# Altium project brian_project.PrjPcb
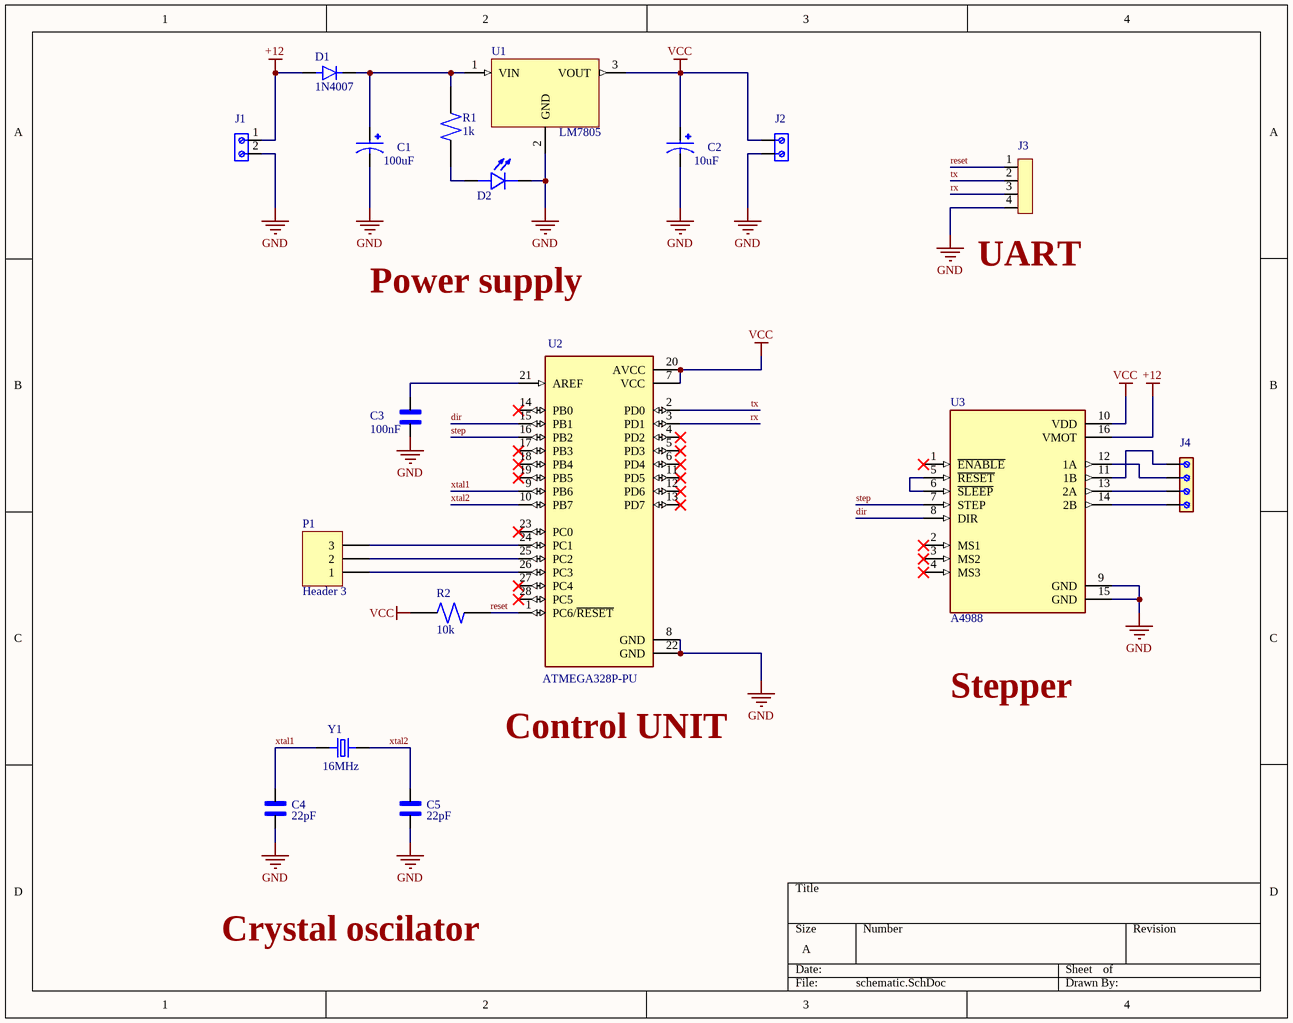
[diagram p0: schematic.SchDoc]
1 sheet, 18 parts. Net scope: global (net labels, ports and power ports of the same name join across sheets).
Board file: PCB_Layout.PcbDoc

## Sheet schematic.SchDoc
size A; SheetNumber: 1; SheetTotal: 1

### Parts
C1  100uF  [CAPPRD500W50D500H1100]
C2  10uF  [CAPPRD500W50D500H1100]
C3  100nF  [CAPRB500W50L450T300H550]
C4  22pF  [CAPRB500W50L450T300H550]
C5  22pF  [CAPRB500W50L450T300H550]
D1  1N4007  [DIOAD1060W80L520D270]
D2  L08R5000Q1  [LEDRD254W57D500H1070]  (value not drawn)
J1  691111710002  [691111710002]  (value not drawn)
J2  691111710002  [691111710002]  (value not drawn)
J3  PPTC041LFBN-RC  [SULLINS_PPTC041LFBN-RC]  (value not drawn)
J4  691241510004  [691241510004]  (value not drawn)
P1  Header 3  [HDR1X3]
R1  1k  [RESAD1100W55L680D260]
R2  10k  [RESAD1100W55L680D260]
U1  LM7805  [TO255P1020X450X1968-3]
U2  ATMEGA328P-PU  [DIP794W46P254L2967H457Q28B]
U3  A4988  [MODULE_A4988_STEPPER_MOTOR_DRIVER_CARRIER]
Y1  16MHz  [XTAL_ECS-160-20-4X]

### Nets
+12: D1.A J1.1 U3.16(VMOT)
GND: C1.N C2.N C3.2 C4.2 C5.2 D2.C J1.2 J2.1 J3.4 U1.2(GND) U2.8(GND) U2.22(GND) U3.9(GND) U3.15(GND)
VCC: C2.P J2.2 R2.1 U1.3(VOUT) U2.7(VCC) U2.20(AVCC) U3.10(VDD)
dir: U2.15(PB1) U3.8(DIR)
reset: J3.1 R2.2 U2.1(PC6/~{RESET})
rx: J3.3 U2.3(PD1)
step: U2.16(PB2) U3.7(STEP)
tx: J3.2 U2.2(PD0)
xtal1: C4.1 U2.9(PB6) Y1.1
xtal2: C5.1 U2.10(PB7) Y1.2
NetC1_P: C1.P D1.C R1.1 U1.1(VIN)
NetC3_1: C3.1 U2.21(AREF)
NetD2_A: D2.A R1.2
NetJ4_1: J4.1 U3.11(1B)
NetJ4_2: J4.2 U3.12(1A)
NetJ4_3: J4.3 U3.13(2A)
NetJ4_4: J4.4 U3.14(2B)
NetP1_1: P1.1 U2.26(PC3)
NetP1_2: P1.2 U2.25(PC2)
NetP1_3: P1.3 U2.24(PC1)
NetU3_5: U3.5(~{RESET}) U3.6(~{SLEEP})

Not connected (* = marked no-connect by the designer): U2 4(PD2)* 5(PD3)* 6(PD4)* 11(PD5)* 12(PD6)* 13(PD7)* 14(PB0)* 17(PB3)* 18(PB4)* 19(PB5)* 23(PC0)* 27(PC4)* 28(PC5)*; U3 1(~{ENABLE})* 2(MS1)* 3(MS2)* 4(MS3)*

### Notes on the sheet
- Power supply
- (near J3) UART
- Stepper
- Control UNIT
- Crystal oscilator

### Library data of the parts
C1 C2 = Electrolytic capacitor: FS-A; MF: {'manufacturer': u'Panasonic'}; MP: EEUFS0J221B; Package: None; Value: *; Availability: Unavailable; Price: None
C3-C5 = Ceramic capacitor: 2200 pF Â±10% 250V Ceramic Capacitor X7R Radial; MF: TDK; MP: FG24X7R2E222KNT06; Digi-Key_Part_Number: 445-173386-1-ND; Purchase-URL: https://pricing.snapeda.com/search/part/FG24X7R2E222KNT06/?ref=eda; Check_prices: https://www.snapeda.com/parts/FG24X7R2E222KNT06/TDK/view-part/?ref=eda; Value: *; Package: Radial TDK; SnapEDA_Link: https://www.snapeda.com/parts/FG24X7R2E222KNT06/TDK/view-part/?ref=snap
D1 = 1N4007: Diode Switching 1KV 1A 2-Pin DO-41; Price: None; MP: 1N4007; Value: *; Availability: Unavailable; Package: None
D2 = LED: LED, Orange, Through Hole, T-1 3/4 (5mm), 30 mA, 2.1 V, 635 nm; MF: {'manufacturer': u'LED Technology'}; Price: None; Package: None; Availability: Unavailable; MP: L08R5000Q1; Value: *
J1 J2 = Terminal Block - 2Pins: 2 Position Wire to Board Terminal Block Horizontal with Board 0.197 _5.00mm_ Through Hole; MF: Wurth Electronics; Value: *; Availability: Unavailable; MP: 691111710002; Price: None; Package: None; SnapEDA_Link: https://www.snapeda.com/parts/691111710002/Wurth%20Electronics%20Inc./view-part/1195092/?ref=snap
J3 = Female header - 4Pins: 4 Position Header Connector Through Hole; MF: Sullins Connector; MP: PPTC041LFBN-RC; Value: *; SnapEDA_Link: https://www.snapeda.com/parts/PPTC041LFBN-RC/Sullins%20Connector%20Solutions/view-part/285917/?ref=snap; Package: None; Availability: Warning; Check_prices: https://www.snapeda.com/parts/PPTC041LFBN-RC/Sullins%20Connector%20Solutions/view-part/285917/?ref=eda; Price: None; Purchase-URL: https://pricing.snapeda.com/search/part/PPTC041LFBN-RC/?ref=eda
J4 = Terminal block - 4Pins: <b>WR-TBL Serie 2415 - 5.08 mm Horizontal Entry Modular w. Rising Cage Clamp</b> <br> <br><b> KIND PROPERTIES </b> <br><br> Pitch 5.08 mm  <br> <br> <b>MATERIAL PROPERTIES </b> <br> <br>Insulator Material PA66  <br>Insulator Flammability Rating UL94 V-0  <br>Terminal Screw Material Steel  <br>Terminal Screw Plating Zinc  <br>Wire Guard Material Copper Alloy  <br> <br> <b>GENERAL INFORMATION </b> <br> <br>Operating Temperature -30 up to +120 Â°C  <br>Compliance ROHS & Reach  <br><br> <b>ELECTRICAL PROPERTIES </b> <br> <br>IR UL 14 A  <br>IR VDE 24 A  <br>Working Voltage [UL] 300 V (AC)  <br>Working Voltage [VDE] 250 V (AC)  <br>Withstanding Voltage [UL] 1600 V (AC)  <br>Withstanding Voltage [VDE] 2000 V (AC)  <br>Contact Resistance 20 mÎ©  <br> <br> <b>MECHANICAL PROPERTIES </b> <br> <br>Wire Strip Length 6  <br>Screw M3  <br> <br> <b>CERTIFICATION </b> <br> <br>UL Approval E150931  <br>VDE Approval 40021365  <br> <br> <b>PACKAGING PROPERTIES </b> <br> <br>Packaging Box  <br> <br> <br><a href="https://www.we-online.com/catalog/media/o79416v209%20Family_WR-TBL_6912427000xx_6912425000xx.jpg" title="Enlarge picture"> <img src="https://www.we-online.com/catalog/media/o79416v209%20Family_WR-TBL_6912427000xx_6912425000xx.jpg" width="320"></a><p> Details see: <a href="https://www.we-online.com/catalog/en/TBL_5_08_2415_HORIZONTAL_ENTRY_W_RISING_CAGE_6912415100xx/">https://www.we-online.com/catalog/en/TBL_5_08_2415_HORIZONTAL_ENTRY_W_RISING_CAGE_6912415100xx/</a><p>  </b>Updated by Ella Wu  2019-11-26<br> </b>2019(C) Wurth Elektronik; MF: WÃ¼rth Elektronik; MP: 691241510004; SnapEDA_Link: https://www.snapeda.com/parts/691241510004/Wurth+Electronics+Inc./view-part/?ref=snap; Availability: In Stock; Package: None; Purchase-URL: https://pricing.snapeda.com/search/part/691241510004/?ref=eda; Check_prices: https://www.snapeda.com/parts/691241510004/Wurth+Electronics+Inc./view-part/?ref=eda; Value: *; Price: None
P1 = Header 3: Header, 3-Pin; LatestRevisionDate: 17-Jul-2002; LatestRevisionNote: Re-released for DXP Platform.; Publisher: Altium Limited
R1 R2 = Resistor (0.25W): (MFR-25FBF52-10K) 10,2 kOhm bei 1% 0,25W, 1/4W Durchbohrlochwiderstand Axial Metal Film; MF: Yageo; Digi-Key_Part_Number: 10.2KXBK-ND; SnapEDA_Link: https://www.snapeda.com/parts/MFR-25FBF52-10K/Yageo/view-part/424333/?ref=snap; Package: Axial Yageo; Purchase-URL: https://pricing.snapeda.com/search/part/MFR-25FBF52-10K/?ref=eda; MP: MFR-25FBF52-10K; Value: *
U1 = LM78__: MP: LM7805CT/NOPB; Price: None; Value: *; Availability: Unavailable; Package: None
U2 = ATMEGA328P-PU: ATmega Series 20 MHz 32 KB Flash 2 KB SRAM 8-Bit Microcontroller - DIP-28; Value: *; MP: ATMEGA328P-PU; Package: None; Availability: Unavailable; Price: None
U3 = A4988_STEPPER_MOTOR_DRIVER_CARRIER: Stepper motor controler; IC: A4988; 1A; Uin mot: 8Ã·35V; Price: None; Value: *; MP: A4988_STEPPER_MOTOR_DRIVER_CARRIER; Package: None; Availability: Unavailable
Y1 = Crystal oscilator: CRYSTAL T/H; MF: {'manufacturer': u'ECS Inc.'}; MP: ECS-160-S-4; Package: None; Value: *; Availability: Unavailable; Price: None